# EAGLE schematic snc98_3x4_Switch-futuba (EAGLE 6.6.0)
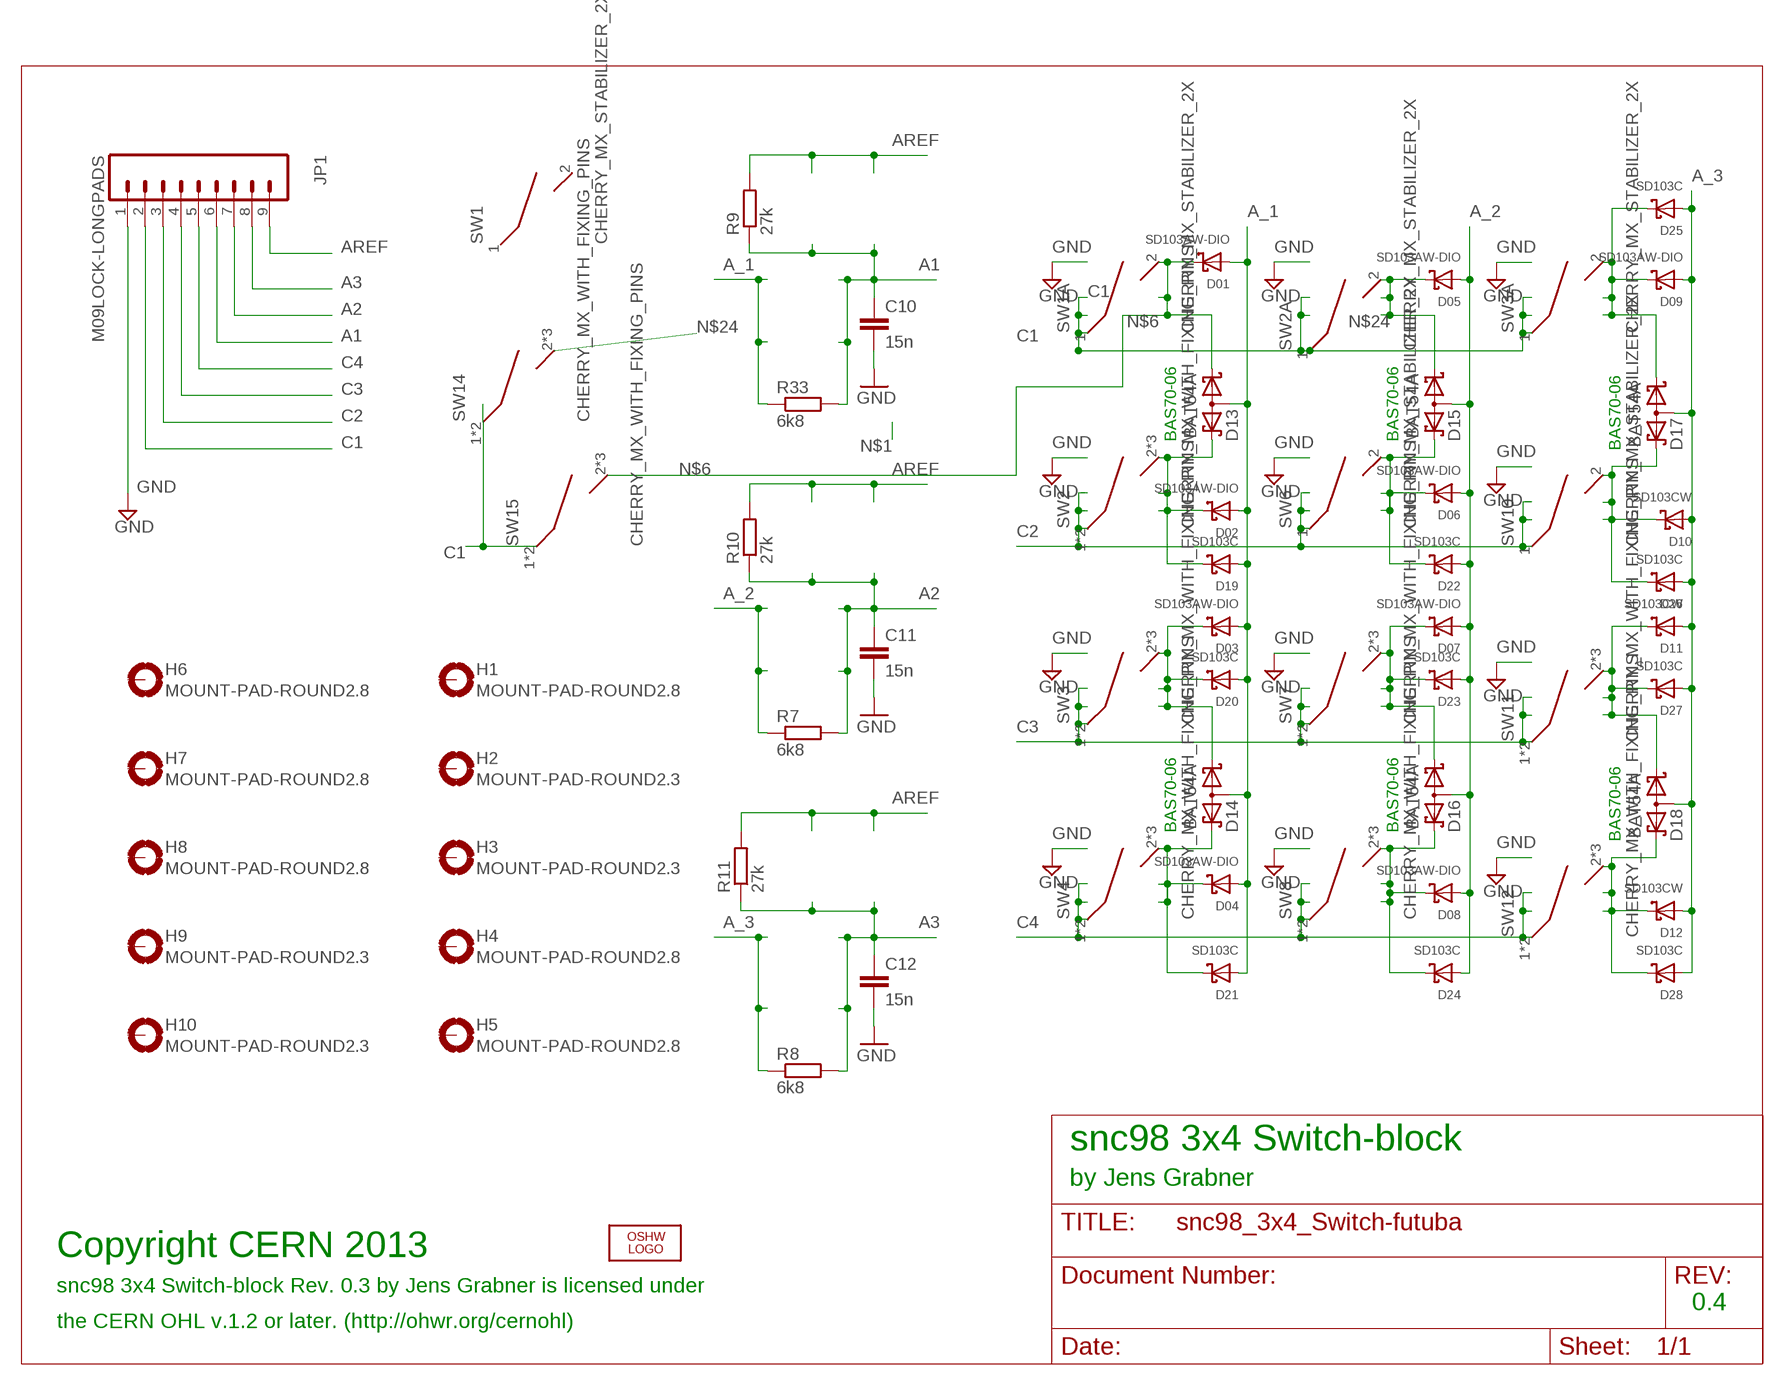
[diagram p0: schematic, sheet 1]

## Parts
C10  15n  C-EUC1206K  [C1206K]
C11  15n  C-EUC1206K  [C1206K]
C12  15n  C-EUC1206K  [C1206K]
D01  SD103AW-DIO  DIODESOD-123F  [SOD-123F]
D02  SD103AW-DIO  DIODESOD-123F  [SOD-123F]
D03  SD103AW-DIO  DIODESOD-123F  [SOD-123F]
D04  SD103AW-DIO  DIODESOD-123F  [SOD-123F]
D05  SD103AW-DIO  DIODESOD-123F  [SOD-123F]
D06  SD103AW-DIO  DIODESOD-123F  [SOD-123F]
D07  SD103AW-DIO  DIODESOD-123F  [SOD-123F]
D08  SD103AW-DIO  DIODESOD-123F  [SOD-123F]
D09  SD103AW-DIO  DIODESOD-123F  [SOD-123F]
D10  SD103CW  DIODESOD-123F  [SOD-123F]
D11  SD103CW  DIODESOD-123F  [SOD-123F]
D12  SD103CW  DIODESOD-123F  [SOD-123F]
D13  BAT54A  [SOT23]
D14  BAT54A  [SOT23]
D15  BAT54A  [SOT23]
D16  BAT54A  [SOT23]
D17  BAT54A  [SOT23]
D18  BAT54A  [SOT23]
D19  SD103C  DIODE280MIL-TH  [280MIL-TH]
D20  SD103C  DIODE280MIL-TH  [280MIL-TH]
D21  SD103C  DIODE280MIL-TH  [280MIL-TH]
D22  SD103C  DIODE280MIL-TH  [280MIL-TH]
D23  SD103C  DIODE280MIL-TH  [280MIL-TH]
D24  SD103C  DIODE280MIL-TH  [280MIL-TH]
D25  SD103C  DIODE280MIL-TH  [280MIL-TH]
D26  SD103C  DIODE280MIL-TH  [280MIL-TH]
D27  SD103C  DIODE280MIL-TH  [280MIL-TH]
D28  SD103C  DIODE280MIL-TH  [280MIL-TH]
H1  MOUNT-PAD-ROUND2.8  [2,8-PAD]
H2  MOUNT-PAD-ROUND2.3  [2,3-PAD]
H3  MOUNT-PAD-ROUND2.3  [2,3-PAD]
H4  MOUNT-PAD-ROUND2.8  [2,8-PAD]
H5  MOUNT-PAD-ROUND2.8  [2,8-PAD]
H6  MOUNT-PAD-ROUND2.8  [2,8-PAD]
H7  MOUNT-PAD-ROUND2.8  [2,8-PAD]
H8  MOUNT-PAD-ROUND2.8  [2,8-PAD]
H9  MOUNT-PAD-ROUND2.3  [2,3-PAD]
H10  MOUNT-PAD-ROUND2.3  [2,3-PAD]
JP1  M09LOCK-LONGPADS  [1X09_LOCK_LONGPADS]
LOGO1  OSHW_LOGO_8MILX0150-NT  [OSHW_8X150_NOTEXT]
R7  6k8  R-EU_M0805  [M0805]
R8  6k8  R-EU_M0805  [M0805]
R9  27k  R-EU_M0805  [M0805]
R10  27k  R-EU_M0805  [M0805]
R11  27k  R-EU_M0805  [M0805]
R33  6k8  R-EU_M0805  [M0805]
SW1  CHERRY_MX_STABILIZER_2X  [MX1A-XXNN_WITH_STABILIZER_2X]
SW1A  CHERRY_MX_STABILIZER_2X  [MX1A-XXNN_WITH_STABILIZER_2X]
SW2  CHERRY_MX_WITH_FIXING_PINS  [MX1A-XXNW]
SW2A  CHERRY_MX_STABILIZER_2X  [MX1A-XXNN_WITH_STABILIZER_2X]
SW3  CHERRY_MX_WITH_FIXING_PINS  [MX1A-XXNW]
SW3A  CHERRY_MX_STABILIZER_2X  [MX1A-XXNN_WITH_STABILIZER_2X]
SW4  CHERRY_MX_WITH_FIXING_PINS  [MX1A-XXNW]
SW6  CHERRY_MX_STABILIZER_2X  [MX1A-XXNN_WITH_STABILIZER_2X]
SW7  CHERRY_MX_WITH_FIXING_PINS  [MX1A-XXNW]
SW8  CHERRY_MX_WITH_FIXING_PINS  [MX1A-XXNW]
SW10  CHERRY_MX_STABILIZER_2X  [MX1A-XXNN_WITH_STABILIZER_2X]
SW11  CHERRY_MX_WITH_FIXING_PINS  [MX1A-XXNW]
SW12  CHERRY_MX_WITH_FIXING_PINS  [MX1A-XXNW]
SW14  CHERRY_MX_WITH_FIXING_PINS  [MX1A-XXNW]
SW15  CHERRY_MX_WITH_FIXING_PINS  [MX1A-XXNW]

## Nets
A1: C10.1 JP1.6 R9.1 R33.2
A2: C11.1 JP1.7 R7.2 R10.1
A3: C12.1 JP1.8 R8.2 R11.1
A_1: D01.A D02.A D03.A D04.A D13.3(AA) D14.3(AA) D19.P$1(A) D20.P$1(A) D21.P$1(A) R33.1
A_2: D05.A D06.A D07.A D08.A D15.3(AA) D16.3(AA) D22.P$1(A) D23.P$1(A) D24.P$1(A) R7.1
A_3: D09.A D10.A D11.A D12.A D17.3(AA) D18.3(AA) D25.P$1(A) D26.P$1(A) D27.P$1(A) D28.P$1(A) R8.1
AREF: JP1.9 R9.2 R10.2 R11.2
C1: JP1.2 SW1A.1 SW2A.1 SW3A.1 SW14.1 SW14.3 SW15.1 SW15.3
C2: JP1.3 SW2.1 SW2.3 SW6.1 SW10.1
C3: JP1.4 SW3.1 SW3.3 SW7.1 SW7.3 SW11.1 SW11.3
C4: JP1.5 SW4.1 SW4.3 SW8.1 SW8.3 SW12.1 SW12.3
GND: C10.2 C11.2 C12.2 JP1.1
N$2: D04.C D14.2(K2) D21.P$2(C) SW4.2 SW4.4 SW4.5
N$6: D01.C D13.1(K1) SW1A.2 SW15.2 SW15.4 SW15.5
N$16: D09.C D17.1(K1) D25.P$2(C) SW3A.2
N$18: D10.C D17.2(K2) D26.P$2(C) SW10.2
N$19: D02.C D13.2(K2) D19.P$2(C) SW2.2 SW2.4 SW2.5
N$21: D11.C D18.1(K1) D27.P$2(C) SW11.2 SW11.4 SW11.5
N$22: D12.C D18.2(K2) D28.P$2(C) SW12.2 SW12.4 SW12.5
N$24: D05.C D15.1(K1) SW2A.2 SW14.2 SW14.4 SW14.5
N$25: D06.C D15.2(K2) D22.P$2(C) SW6.2
N$28: D07.C D16.1(K1) D23.P$2(C) SW7.2 SW7.4 SW7.5
N$30: D08.C D16.2(K2) D24.P$2(C) SW8.2 SW8.4 SW8.5
N$32: D03.C D14.1(K1) D20.P$2(C) SW3.2 SW3.4 SW3.5
Unconnected: H1.B2,8(MOUNT) H2.B2,8(MOUNT) H3.B2,8(MOUNT) H4.B2,8(MOUNT) H5.B2,8(MOUNT) H6.B2,8(MOUNT) H7.B2,8(MOUNT) H8.B2,8(MOUNT) H9.B2,8(MOUNT) H10.B2,8(MOUNT) SW1.1 SW1.2

## Notes on the sheet
- BAS70-06 | BAS70-06
- BAS70-06
- BAS70-06 | BAS70-06
- BAS70-06
- snc98 3x4 Switch-block
- by Jens Grabner
- Copyright CERN 2013
- snc98 3x4 Switch-block Rev. 0.3 by Jens Grabner is licensed under
- 0.4
- the CERN OHL v.1.2 or later. (http://ohwr.org/cernohl)

## Library data of the parts
C10-C12 = rcl:C-EU: CAPACITOR, European symbol; OC_FARNELL: unknown; TME_EU: CC0805KRX7R9153
D01-D09 D10-D12 D19-D28 = BaseApp:DIODE; MF: MULTICOMP; MPN: SD103CW-7-F; OC_FARNELL: 2306221
D13-D18 = diode:BAT54A: Schottky Diodes Source: Fairchild .. BAT54.pdf; OC_FARNELL: unknown
H1-H10 = holes:MOUNT-PAD-ROUND: MOUNTING PAD, round; OC_FARNELL: unknown
JP1 = SparkFun-Connectors:M09: Header 9 Standard 9-pin 0.1" header. Use with straight break away headers (SKU : PRT-00116), right angle break away headers (PRT-00553), swiss pins (PRT-00743), machine pins (PRT-00117), and female headers (PRT-00115).; OC_FARNELL: unknown
LOGO1 = ohw-logo:OSHW_LOGO_8MIL; OC_FARNELL: unknown
R7 R8 R33 = rcl:R-EU_: RESISTOR, European symbol; OC_FARNELL: unknown; TME_EU: RC0805FR-076K8
R9-R11 = rcl:R-EU_: RESISTOR, European symbol; OC_FARNELL: unknown; TME_EU: RC0805FR-0727K
SW1 SW1A SW2 SW2A SW3 SW3A SW4 SW6-SW8 SW10-SW12 SW14 SW15 = Cherry_MX_v7.0:CHERRY_MX

## Net classes
0 default: clearance 0.205 mm